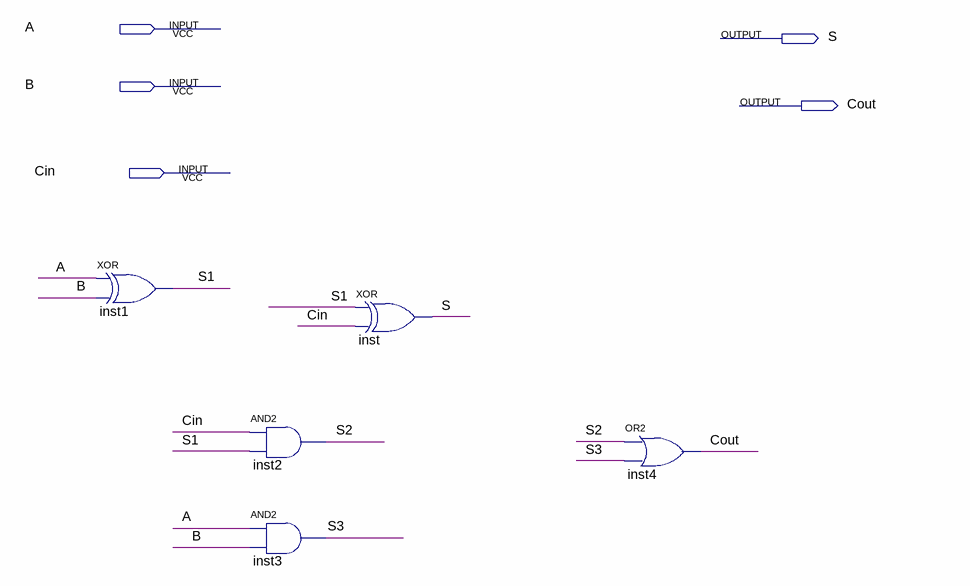
[diagram p0: schematic sheet]
// Quartus schematic FA.bdf as structural Verilog: 5 symbols, 5 pins
module FA (
  input  A,
  input  B,
  input  Cin,
  output S,
  output Cout
);

  wire S1, S2, S3;

  xor inst1 (S1, A, B);
  and inst2 (S2, Cin, S1);
  and inst3 (S3, A, B);
  xor inst (S, S1, Cin);
  or inst4 (Cout, S2, S3);
endmodule
